# Altium project Motor_Controller.PrjPcb
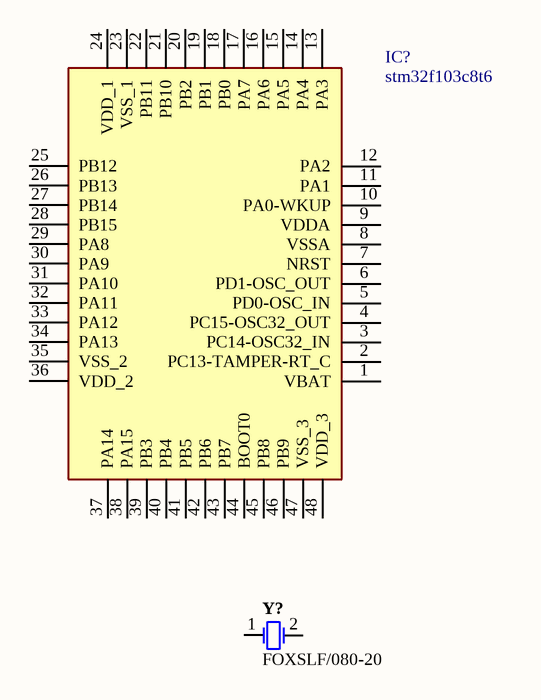
[diagram p0: Microcontroller.SchDoc]
2 sheets, 6 parts. Net scope: global (net labels, ports and power ports of the same name join across sheets).
Board file: PCB.PcbDoc
Sheets:
  Microcontroller.SchDoc
  Motor_Drivers.SchDoc

## Sheet Microcontroller.SchDoc
size A4; SheetNumber: 1; SheetTotal: 2

### Parts
(Parts that share a designator on the sheet are numbered #1, #2 ... from top to bottom, then left to right.)
IC?#1  stm32f103c8t6  [QFP50P900X900X160-48N]
Y?  FOXSLF/080-20  [FOX-FOXSLF080-20]

### Nets

Not connected (* = marked no-connect by the designer): IC?#1 1(VBAT) 2(PC13-TAMPER-RT_C) 3(PC14-OSC32_IN) 4(PC15-OSC32_OUT) 5(PD0-OSC_IN) 6(PD1-OSC_OUT) 7(NRST) 8(VSSA) 9(VDDA) 10(PA0-WKUP) 11(PA1) 12(PA2) 13(PA3) 14(PA4) 15(PA5) 16(PA6) 17(PA7) 18(PB0) 19(PB1) 20(PB2) 21(PB10) 22(PB11) 23(VSS_1) 24(VDD_1) 25(PB12) 26(PB13) 27(PB14) 28(PB15) 29(PA8) 30(PA9) 31(PA10) 32(PA11) 33(PA12) 34(PA13) 35(VSS_2) 36(VDD_2) 37(PA14) 38(PA15) 39(PB3) 40(PB4) 41(PB5) 42(PB6) 43(PB7) 44(BOOT0) 45(PB8) 46(PB9) 47(VSS_3) 48(VDD_3); Y? 1 2

### Library data of the parts
IC?#1 = stm32f103c8t6: Integrated Circuit; Manufacturer_Name: STMicroelectronics; Datasheet Link: http://media.digikey.com/pdf/Data%20Sheets/ST%20Microelectronics%20PDFS/STM32F103x8,B.pdf; Height: 1.6mm; Manufacturer_Part_Number: stm32f103c8t6; Mouser Part Number: 511-STM32F103C8T6; Mouser Price/Stock: https://www.mouser.co.uk/ProductDetail/STMicroelectronics/STM32F103C8T6?qs=bhCVus9SdFtq6kqxsU5%2FDA%3D%3D; Arrow Part Number: STM32F103C8T6; Arrow Price/Stock: https://www.arrow.com/en/products/stm32f103c8t6/stmicroelectronics?utm_currency=USD&region=nac
Y? = CMP-1749-00002-1: Resistance Weld Thru-Hole Crystal, 8 MHz, -20 to 70 degC, 2-Pin THD, RoHS, Bulk; Dropout Voltage: 2 V; Outputs: 1; Nominal Output Voltage: 5 V; Min Input Voltage: 7 V; Case\Package: TO-263-3; Max Input Voltage: 35 V; Max Ouput Current: 1 A; Length: 10.24 mm; Max Operating Temperature: 125 degC; Mount: Surface Mount; PackageDescription: 2-Pin Through Hole Device, Body 11.35 x 4.65 mm; Package Quantity: 50; Pins: 3; ComponentLink2URL: http://download.siliconexpert.com/pdfs/2015/4/5/6/5/7/200/fox_/manual/35607121449963728hc49slf.pdf; PackageReference: FOXSLF080-20; Min Operating Temperature: 0 degC; Height: 30.02 mm; Packaging: Rail/Tube; Radiation Hardening: No; Width: 9.35 mm; ComponentLink1URL: http://www.foxonline.com/; DatasheetVersion: Mar-15; ComponentLink1Description: Manufacturer URL; Output Voltage: 5 V; RoHSCompliant: true; REACH SVHC: No SVHC; Output Current: 1 A; ComponentLink2Description: Datasheet

## Sheet Motor_Drivers.SchDoc
size A4; SheetNumber: 2; SheetTotal: 2
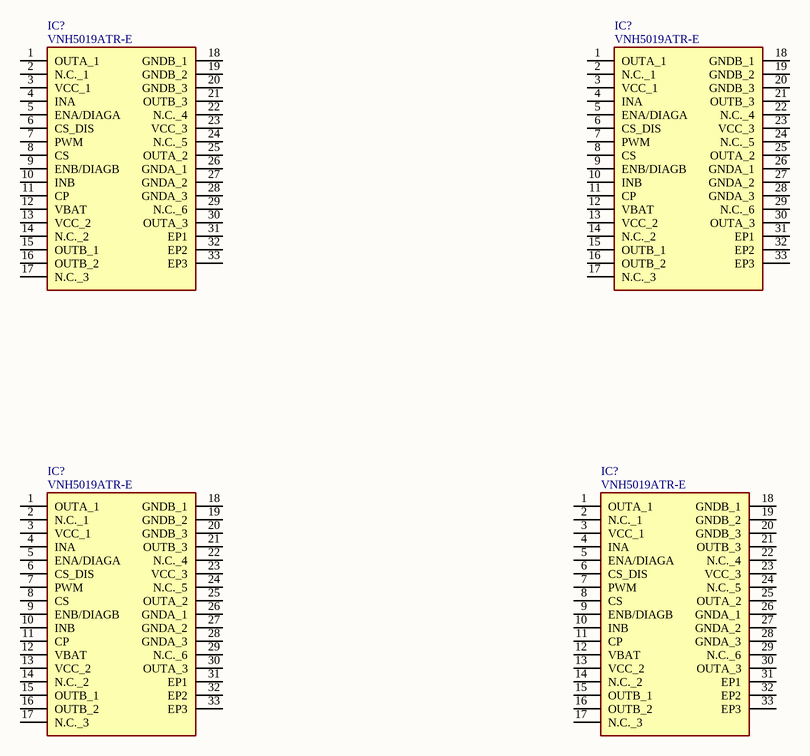
[diagram p1: Motor_Drivers.SchDoc]

### Parts
(Parts that share a designator on the sheet are numbered #1, #2 ... from top to bottom, then left to right.)
IC?#2  VNH5019ATR-E  [VNH5019A-E_1]
IC?#3  VNH5019ATR-E  [VNH5019A-E_1]
IC?#4  VNH5019ATR-E  [VNH5019A-E_1]
IC?#5  VNH5019ATR-E  [VNH5019A-E_1]

### Nets

Not connected (* = marked no-connect by the designer): IC?#2 1(OUTA_1) 2(N.C._1) 3(VCC_1) 4(INA) 5(ENA/DIAGA) 6(CS_DIS) 7(PWM) 8(CS) 9(ENB/DIAGB) 10(INB) 11(CP) 12(VBAT) 13(VCC_2) 14(N.C._2) 15(OUTB_1) 16(OUTB_2) 17(N.C._3) 18(GNDB_1) 19(GNDB_2) 20(GNDB_3) 21(OUTB_3) 22(N.C._4) 23(VCC_3) 24(N.C._5) 25(OUTA_2) 26(GNDA_1) 27(GNDA_2) 28(GNDA_3) 29(N.C._6) 30(OUTA_3) 31(EP1) 32(EP2) 33(EP3); IC?#3 1(OUTA_1) 2(N.C._1) 3(VCC_1) 4(INA) 5(ENA/DIAGA) 6(CS_DIS) 7(PWM) 8(CS) 9(ENB/DIAGB) 10(INB) 11(CP) 12(VBAT) 13(VCC_2) 14(N.C._2) 15(OUTB_1) 16(OUTB_2) 17(N.C._3) 18(GNDB_1) 19(GNDB_2) 20(GNDB_3) 21(OUTB_3) 22(N.C._4) 23(VCC_3) 24(N.C._5) 25(OUTA_2) 26(GNDA_1) 27(GNDA_2) 28(GNDA_3) 29(N.C._6) 30(OUTA_3) 31(EP1) 32(EP2) 33(EP3); IC?#4 1(OUTA_1) 2(N.C._1) 3(VCC_1) 4(INA) 5(ENA/DIAGA) 6(CS_DIS) 7(PWM) 8(CS) 9(ENB/DIAGB) 10(INB) 11(CP) 12(VBAT) 13(VCC_2) 14(N.C._2) 15(OUTB_1) 16(OUTB_2) 17(N.C._3) 18(GNDB_1) 19(GNDB_2) 20(GNDB_3) 21(OUTB_3) 22(N.C._4) 23(VCC_3) 24(N.C._5) 25(OUTA_2) 26(GNDA_1) 27(GNDA_2) 28(GNDA_3) 29(N.C._6) 30(OUTA_3) 31(EP1) 32(EP2) 33(EP3); IC?#5 1(OUTA_1) 2(N.C._1) 3(VCC_1) 4(INA) 5(ENA/DIAGA) 6(CS_DIS) 7(PWM) 8(CS) 9(ENB/DIAGB) 10(INB) 11(CP) 12(VBAT) 13(VCC_2) 14(N.C._2) 15(OUTB_1) 16(OUTB_2) 17(N.C._3) 18(GNDB_1) 19(GNDB_2) 20(GNDB_3) 21(OUTB_3) 22(N.C._4) 23(VCC_3) 24(N.C._5) 25(OUTA_2) 26(GNDA_1) 27(GNDA_2) 28(GNDA_3) 29(N.C._6) 30(OUTA_3) 31(EP1) 32(EP2) 33(EP3)

### Library data of the parts
IC?#2-IC?#5 = VNH5019ATR-E: Integrated Circuit; Manufacturer_Name: STMicroelectronics; Datasheet Link: https://www.st.com/resource/en/datasheet/vnh5019a-e.pdf; Manufacturer_Part_Number: VNH5019ATR-E; Mouser Part Number: 511-VNH5019ATR-E; Mouser Price/Stock: https://www.mouser.co.uk/ProductDetail/STMicroelectronics/VNH5019ATR-E?qs=T%2FOtf55vL7cDceYVZzSNKw%3D%3D; Arrow Part Number: VNH5019ATR-E; Arrow Price/Stock: https://www.arrow.com/en/products/vnh5019atr-e/stmicroelectronics?region=nac